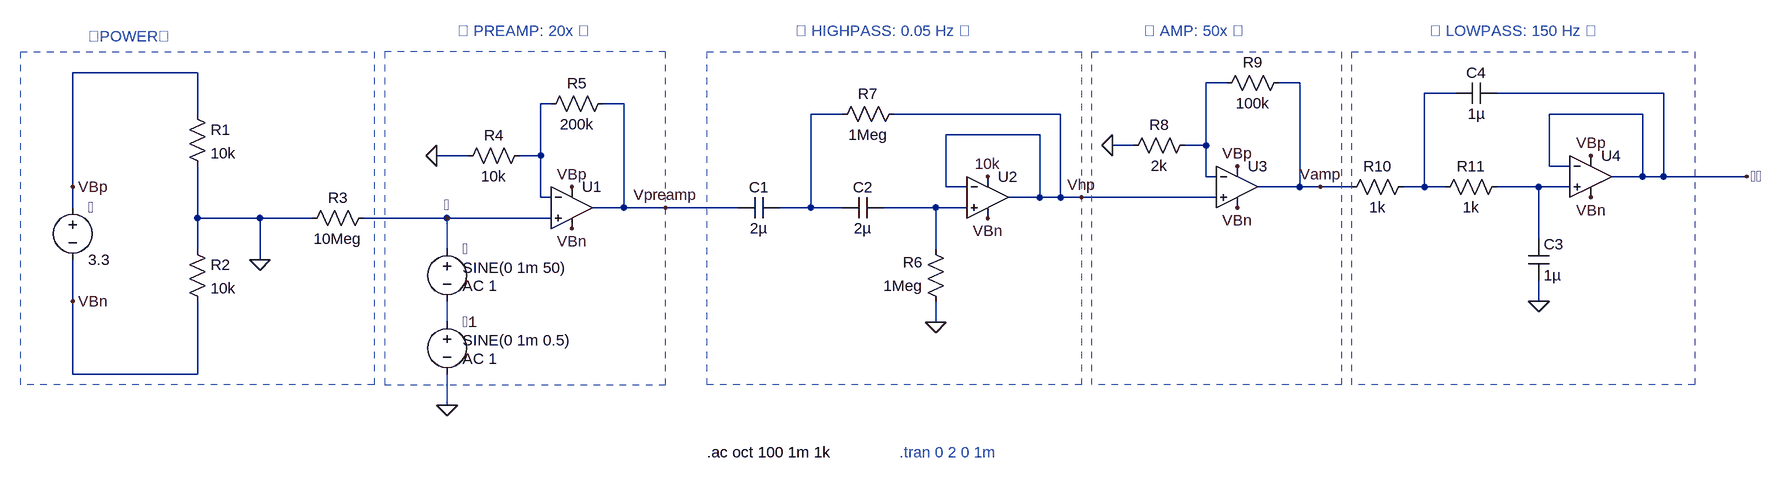
[diagram p0: schematic ecg_amp_filter_floatGround.asc]
ecg_amp_filter_floatGround.asc, the LTspice schematic file:
Version 4
SHEET 1 2624 680
WIRE 160 -1744 -32 -1744
WIRE 1744 -1728 1712 -1728
WIRE 1856 -1728 1824 -1728
WIRE 2096 -1712 2048 -1712
WIRE 2416 -1712 2160 -1712
WIRE 704 -1696 688 -1696
WIRE 816 -1696 784 -1696
WIRE 160 -1680 160 -1744
WIRE 1152 -1680 1104 -1680
WIRE 1488 -1680 1232 -1680
WIRE 2384 -1680 2240 -1680
WIRE 1456 -1648 1312 -1648
WIRE 1600 -1632 1568 -1632
WIRE 1712 -1632 1712 -1728
WIRE 1712 -1632 1680 -1632
WIRE 576 -1616 528 -1616
WIRE 688 -1616 688 -1696
WIRE 688 -1616 656 -1616
WIRE 2240 -1600 2240 -1680
WIRE 2272 -1600 2240 -1600
WIRE 1712 -1584 1712 -1632
WIRE 1728 -1584 1712 -1584
WIRE 2384 -1584 2384 -1680
WIRE 2384 -1584 2336 -1584
WIRE 2416 -1584 2416 -1712
WIRE 2416 -1584 2384 -1584
WIRE 2544 -1584 2416 -1584
WIRE -32 -1568 -32 -1744
WIRE 1312 -1568 1312 -1648
WIRE 1344 -1568 1312 -1568
WIRE 1856 -1568 1856 -1728
WIRE 1856 -1568 1792 -1568
WIRE 1888 -1568 1856 -1568
WIRE 1936 -1568 1888 -1568
WIRE 2048 -1568 2048 -1712
WIRE 2048 -1568 2016 -1568
WIRE 2080 -1568 2048 -1568
WIRE 2224 -1568 2160 -1568
WIRE 2272 -1568 2224 -1568
WIRE 688 -1552 688 -1616
WIRE 704 -1552 688 -1552
WIRE 1456 -1552 1456 -1648
WIRE 1456 -1552 1408 -1552
WIRE 1488 -1552 1488 -1680
WIRE 1488 -1552 1456 -1552
WIRE 1520 -1552 1488 -1552
WIRE 1728 -1552 1520 -1552
WIRE -32 -1536 -32 -1568
WIRE 816 -1536 816 -1696
WIRE 816 -1536 768 -1536
WIRE 880 -1536 816 -1536
WIRE 992 -1536 880 -1536
WIRE 1104 -1536 1104 -1680
WIRE 1104 -1536 1056 -1536
WIRE 1152 -1536 1104 -1536
WIRE 1296 -1536 1216 -1536
WIRE 1344 -1536 1296 -1536
WIRE 160 -1520 160 -1600
WIRE 256 -1520 160 -1520
WIRE 336 -1520 256 -1520
WIRE 544 -1520 416 -1520
WIRE 704 -1520 544 -1520
WIRE 2224 -1488 2224 -1568
WIRE 160 -1472 160 -1520
WIRE 544 -1472 544 -1520
WIRE 1296 -1472 1296 -1536
WIRE 256 -1456 256 -1520
WIRE -32 -1392 -32 -1456
WIRE 2224 -1392 2224 -1424
WIRE 544 -1360 544 -1392
WIRE 1296 -1360 1296 -1392
WIRE -32 -1280 -32 -1392
WIRE 160 -1280 160 -1392
WIRE 160 -1280 -32 -1280
WIRE 544 -1232 544 -1280
FLAG 256 -1456 0
FLAG 544 -1232 0
FLAG 528 -1616 0
FLAG -32 -1568 VBp
FLAG -32 -1392 VBn
FLAG 736 -1504 VBn
FLAG 736 -1568 VBp
FLAG 1296 -1360 0
FLAG 1376 -1584 10k
FLAG 1376 -1520 VBn
FLAG 1568 -1632 0
FLAG 1760 -1600 VBp
FLAG 1760 -1536 VBn
FLAG 2224 -1392 0
FLAG 2304 -1616 VBp
FLAG 2304 -1552 VBn
FLAG 2544 -1584 🧡💻
FLAG 544 -1520 💛
FLAG 880 -1536 Vpreamp
FLAG 1520 -1552 Vhp
FLAG 1888 -1568 Vamp
SYMBOL voltage -32 -1552 R0
WINDOW 123 0 0 Left 0
WINDOW 39 0 0 Left 0
SYMATTR InstName 🔋
SYMATTR Value 3.3
SYMBOL voltage 544 -1488 R0
WINDOW 3 24 44 Left 2
WINDOW 123 24 72 Left 2
WINDOW 39 0 0 Left 0
SYMATTR Value SINE(0 1m 50)
SYMATTR Value2 AC 1
SYMATTR InstName 🤍
SYMBOL res 144 -1696 R0
SYMATTR InstName R1
SYMATTR Value 10k
SYMBOL res 144 -1488 R0
SYMATTR InstName R2
SYMATTR Value 10k
SYMBOL res 320 -1504 R270
WINDOW 0 32 56 VTop 2
WINDOW 3 0 56 VBottom 2
SYMATTR InstName R3
SYMATTR Value 10Meg
SYMBOL OpAmps\\UniversalOpAmp 736 -1536 R0
SYMATTR InstName U1
SYMBOL res 560 -1600 R270
WINDOW 0 32 56 VTop 2
WINDOW 3 0 56 VBottom 2
SYMATTR InstName R4
SYMATTR Value 10k
SYMBOL res 800 -1712 R90
WINDOW 0 0 56 VBottom 2
WINDOW 3 32 56 VTop 2
SYMATTR InstName R5
SYMATTR Value 200k
SYMBOL cap 992 -1520 R270
WINDOW 0 32 32 VTop 2
WINDOW 3 0 32 VBottom 2
SYMATTR InstName C1
SYMATTR Value 2µ
SYMBOL cap 1152 -1520 R270
WINDOW 0 32 32 VTop 2
WINDOW 3 0 32 VBottom 2
SYMATTR InstName C2
SYMATTR Value 2µ
SYMBOL res 1312 -1376 R180
WINDOW 0 36 76 Left 2
WINDOW 3 36 40 Left 2
SYMATTR InstName R6
SYMATTR Value 1Meg
SYMBOL res 1136 -1664 R270
WINDOW 0 32 56 VTop 2
WINDOW 3 0 56 VBottom 2
SYMATTR InstName R7
SYMATTR Value 1Meg
SYMBOL OpAmps\\UniversalOpAmp 1376 -1552 R0
SYMATTR InstName U2
SYMBOL OpAmps\\UniversalOpAmp 1760 -1568 R0
SYMATTR InstName U3
SYMBOL res 1696 -1648 R90
WINDOW 0 0 56 VBottom 2
WINDOW 3 32 56 VTop 2
SYMATTR InstName R8
SYMATTR Value 2k
SYMBOL res 1840 -1744 R90
WINDOW 0 0 56 VBottom 2
WINDOW 3 32 56 VTop 2
SYMATTR InstName R9
SYMATTR Value 100k
SYMBOL OpAmps\\UniversalOpAmp 2304 -1584 R0
SYMATTR InstName U4
SYMBOL res 2032 -1584 R90
WINDOW 0 0 56 VBottom 2
WINDOW 3 32 56 VTop 2
SYMATTR InstName R10
SYMATTR Value 1k
SYMBOL res 2176 -1584 R90
WINDOW 0 0 56 VBottom 2
WINDOW 3 32 56 VTop 2
SYMATTR InstName R11
SYMATTR Value 1k
SYMBOL cap 2208 -1488 R0
SYMATTR InstName C3
SYMATTR Value 1µ
SYMBOL cap 2160 -1728 R90
WINDOW 0 0 32 VBottom 2
WINDOW 3 32 32 VTop 2
SYMATTR InstName C4
SYMATTR Value 1µ
SYMBOL voltage 544 -1376 R0
WINDOW 3 24 44 Left 2
WINDOW 123 24 72 Left 2
WINDOW 39 0 0 Left 0
SYMATTR Value SINE(0 1m 0.5)
SYMATTR Value2 AC 1
SYMATTR InstName 🤍1
TEXT 944 -1160 Left 2 !.ac oct 100 1m 1k
TEXT -8 -1800 Left 2 ;⚡POWER⚡
TEXT 560 -1808 Left 2 ;⏫ PREAMP: 20x ⏫
TEXT 1080 -1808 Left 2 ;⏩ HIGHPASS: 0.05 Hz ⏩
TEXT 2056 -1808 Left 2 ;⏪ LOWPASS: 150 Hz ⏪
TEXT 1616 -1808 Left 2 ;⏫ AMP: 50x ⏫
TEXT 1240 -1160 Left 2 ;.tran 0 2 0 1m
RECTANGLE Normal 432 -1264 -112 -1776 2
RECTANGLE Normal 880 -1776 448 -1264 2
RECTANGLE Normal 1520 -1264 944 -1776 2
RECTANGLE Normal 1920 -1264 1536 -1776 2
RECTANGLE Normal 2464 -1264 1936 -1776 2

The netlist it stands for:
* ecg_amp_filter_floatGround.asc
V§🔋 VBp VBn 3.3
V§🤍 💛 N007 SINE(0 1m 50) AC 1
R1 VBp 0 10k
R2 0 VBn 10k
R3 0 💛 10Meg
XU1 💛 N003 VBp VBn Vpreamp level1 Avol=1Meg GBW=10Meg Vos=0 En=0 Enk=0 In=0 Ink=0 Rin=500Meg  ; pins In+ In- V+ V- OUT
R4 0 N003 10k
R5 Vpreamp N003 200k
C1 Vpreamp N004 2µ
C2 N004 N006 2µ
R6 0 N006 1Meg
R7 N004 Vhp 1Meg
XU2 N006 Vhp 10k VBn Vhp level1 Avol=1Meg GBW=10Meg Vos=0 En=0 Enk=0 In=0 Ink=0 Rin=500Meg  ; pins In+ In- V+ V- OUT
XU3 Vhp N001 VBp VBn Vamp level1 Avol=1Meg GBW=10Meg Vos=0 En=0 Enk=0 In=0 Ink=0 Rin=500Meg  ; pins In+ In- V+ V- OUT
R8 N001 0 2k
R9 Vamp N001 100k
XU4 N005 🧡💻 VBp VBn 🧡💻 level1 Avol=1Meg GBW=10Meg Vos=0 En=0 Enk=0 In=0 Ink=0 Rin=500Meg  ; pins In+ In- V+ V- OUT
R10 N002 Vamp 1k
R11 N005 N002 1k
C3 N005 0 1µ
C4 🧡💻 N002 1µ
V§🤍1 N007 0 SINE(0 1m 0.5) AC 1
.ac oct 100 1m 1k
* ⚡POWER⚡
* ⏫ PREAMP: 20x ⏫
* ⏩ HIGHPASS: 0.05 Hz ⏩
* ⏪ LOWPASS: 150 Hz ⏪
* ⏫ AMP: 50x ⏫
* .tran 0 2 0 1m
.lib UniversalOpAmp1.lib
.backanno
.end